# EAGLE design COMP3C (EAGLE 8.4.1)

## Sheet 1 of 3
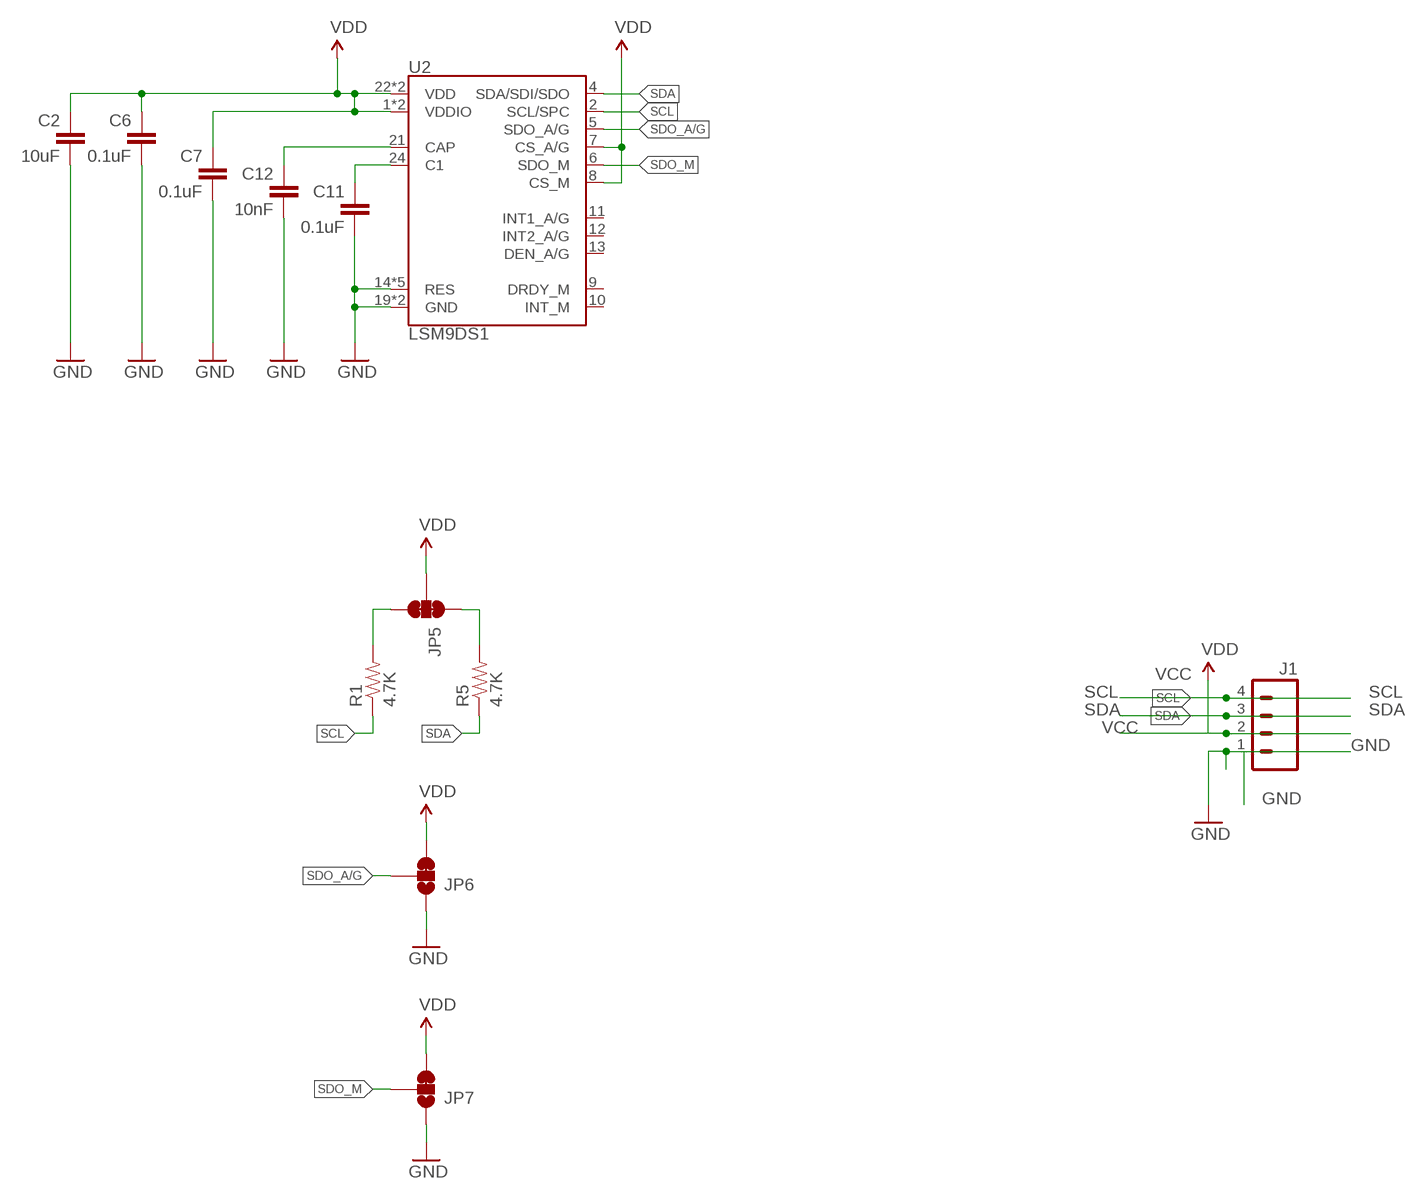
[diagram p0: schematic, sheet 1]

### Parts
C2  10uF  10UF-6.3V-20%(0603)  [0603-CAP]
C6  0.1uF  0.1UF-25V(+80/-20%)(0603)  [0603-CAP]
C7  0.1uF  0.1UF-25V(+80/-20%)(0603)  [0603-CAP]
C11  0.1uF  0.1UF-25V(+80/-20%)(0603)  [0603-CAP]
C12  10nF  10NF/10000PF-50V-10%(0603)  [0603-CAP]
J1  M04NO_SILK_ALL_ROUND  [1X04_NO_SILK_ALL_ROUND]
JP5  JUMPER-PAD-3-NC_BY_TRACE  [PAD-JUMPER-3-3OF3_NC_BY_TRACE_YES_SILK_FULL_BOX]
JP6  JUMPER-PAD-3-2OF3_NC_BY_TRACE_SMALL  [PAD-JUMPER-3-2OF3_NC_BY_TRACE_YES_SILK_FULL_BOX]
JP7  JUMPER-PAD-3-2OF3_NC_BY_TRACE_SMALL  [PAD-JUMPER-3-2OF3_NC_BY_TRACE_YES_SILK_FULL_BOX]
R1  4.7K  4.7KOHM-1/10W-1%(0603)  [0603-RES]
R5  4.7K  4.7KOHM-1/10W-1%(0603)  [0603-RES]
U2  LSM9DS1  [LGA24-8X4]

### Nets
GND: C2.2 C6.2 C7.2 C11.2 C12.2 J1.1 JP6.1 JP7.1 U2.14(RES) U2.15(RES) U2.16(RES) U2.17(RES) U2.18(RES) U2.19(GND) U2.20(GND) ; also sheet 2,3
N$1: JP5.1 R5.2
N$2: JP5.3 R1.2
N$5: C12.1 U2.21(CAP)
N$6: C11.1 U2.24(C1)
SCL: J1.4 R1.1 U2.2(SCL/SPC) ; also sheet 2,3
SDA: J1.3 R5.1 U2.4(SDA/SDI/SDO) ; also sheet 2,3
SDO_A/G: JP6.2 U2.5(SDO_A/G)
SDO_M: JP7.2 U2.6(SDO_M)
VCC: C2.1 C6.1 C7.1 J1.2 JP5.2 JP6.3 JP7.3 U2.1(VDDIO) U2.3(VDDIO) U2.7(CS_A/G) U2.8(CS_M) U2.22(VDD) U2.23(VDD) ; supply symbol labelled VDD ; also sheet 2,3
Unconnected: U2.9(DRDY_M) U2.10(INT_M) U2.11(INT1_A/G) U2.12(INT2_A/G) U2.13(DEN_A/G)

## Sheet 2 of 3
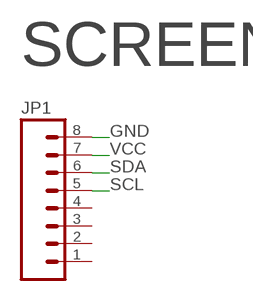
[diagram p1: schematic, sheet 2]

### Parts
JP1  M08LOCK  [1X08_LOCK]

### Nets
GND: JP1.8 ; also sheet 1,3
SCL: JP1.5 ; also sheet 1,3
SDA: JP1.6 ; also sheet 1,3
VCC: JP1.7 ; also sheet 1,3
Unconnected: JP1.1 JP1.2 JP1.3 JP1.4

### Notes on the sheet
- SCREEN

## Sheet 3 of 3
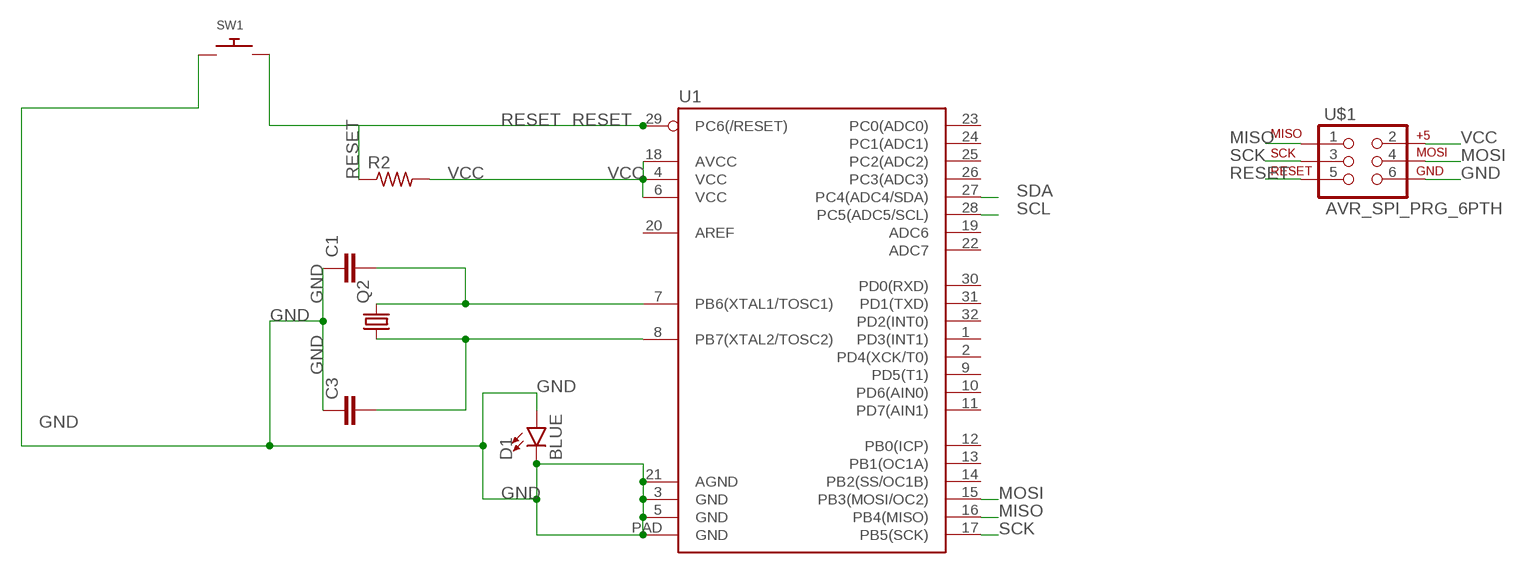
[diagram p2: schematic, sheet 3]

### Parts
C1  C  [C0805]
C3  C  [C0805]
D1  BLUE  LED-BLUE0603  [LED-0603]
Q2  CRYSTALHC49S  [HC49/S]
R2  R-US_R0402  [R0402]
SW1  SWITCH_PUSHBUTTONC&K_KSS  [BTN_CK_KSS]
U1  ATMEGA328P_MLFMLF32  [MLF32-PAD]
U$1  AVR_SPI_PRG_6PTH  [2X3]

### Nets
GND: C1.1 C3.1 D1.A D1.C SW1.P$1 U1.3(GND) U1.5(GND) U1.21(AGND) U1.PAD(GND) U$1.6 ; also sheet 1,2
MISO: U1.16(PB4(MISO)) U$1.1
MOSI: U1.15(PB3(MOSI/OC2)) U$1.4
N$3: C3.2 Q2.1 U1.8(PB7(XTAL2/TOSC2))
N$4: C1.2 Q2.2 U1.7(PB6(XTAL1/TOSC1))
RESET: R2.1 SW1.P$2 U1.29(PC6(/RESET)) U$1.5
SCK: U1.17(PB5(SCK)) U$1.3
SCL: U1.28(PC5(ADC5/SCL)) ; also sheet 1,2
SDA: U1.27(PC4(ADC4/SDA)) ; also sheet 1,2
VCC: R2.2 U1.4(VCC) U1.6(VCC) U1.18(AVCC) U$1.2 ; also sheet 1,2
Unconnected: U1.1(PD3(INT1)) U1.2(PD4(XCK/T0)) U1.9(PD5(T1)) U1.10(PD6(AIN0)) U1.11(PD7(AIN1)) U1.12(PB0(ICP)) U1.13(PB1(OC1A)) U1.14(PB2(SS/OC1B)) U1.19(ADC6) U1.20(AREF) U1.22(ADC7) U1.23(PC0(ADC0)) U1.24(PC1(ADC1)) U1.25(PC2(ADC2)) U1.26(PC3(ADC3)) U1.30(PD0(RXD)) U1.31(PD1(TXD)) U1.32(PD2(INT0))

## Library data of the parts
C1 C3 = eagle-ltspice:C: CAPACITOR, European symbol; MPN: C0805C274K3RACTU; OC_NEWARK: 07X0924; SPICEMODEL: NONE; SPICEPREFIX: C
C2 = SparkFun-Capacitors:10UF-6.3V-20%(0603): CAP-11015; MPN: GRM188C81C106MA73D; OC_NEWARK: 03AC2642; PROD_ID: CAP-11015
C6 C7 C11 = SparkFun-Capacitors:0.1UF-25V(+80/-20%)(0603): CAP-00810 Ceramic Standard decoupling cap; MPN: C0603C104K5RACAUTO; OC_NEWARK: 05AC7990; PROD_ID: CAP-00810
C12 = SparkFun-Capacitors:10NF/10000PF-50V-10%(0603): CAP-00867; MPN: EMK107SD103KA-T; OC_NEWARK: 09J1395; PROD_ID: CAP-00867
D1 = SparkFun-LED:LED-BLUE: Blue SMD LED Used in manufacturing of various products at SparkFun Packages: 0603 - SMD 0603 package [Product Link] <http://www.digikey.com/product-detail/en/SMLE12BC7TT86/511-1589-2-ND/1641808> 1206 - SMD1206 package [Product Link] <http://www.digikey.com/product-detail/en/lite-on-inc/LTST-C150TBKT/160-1643-1-ND/573584> SparkFun Products: ESP8266 Thing-Dev Board <https://www.sparkfun.com/products/13711> RedBoard <https://www.sparkfun.com/products/12757>; MPN: HSMR-C120; OC_NEWARK: 97K1682; PROD_ID: DIO-08575
J1 = SparkFun-Connectors:M04: Header 4 Standard 4-pin 0.1" header. Use with straight break away headers (SKU : PRT-00116), right angle break away headers (PRT-00553), swiss pins (PRT-00743), machine pins (PRT-00117), and female headers (PRT-00115). Molex polarized connector foot print use with SKU : PRT-08231 with associated crimp pins and housings. 1MM SMD Version SKU: PRT-10208; OC_NEWARK: unknown; PROD_ID: CONN-09696
JP1 = SparkFun:M08: Header 8 Standard 8-pin 0.1" header. Use with straight break away headers (SKU : PRT-00116), right angle break away headers (PRT-00553), swiss pins (PRT-00743), machine pins (PRT-00117), and female headers (PRT-00115).; OC_NEWARK: unknown
JP5 = SparkFun-Passives:JUMPER-PAD-3-NC_BY_TRACE; OC_NEWARK: unknown
JP6 JP7 = SparkFun-Passives:JUMPER-PAD-3-2OF3_NC_BY_TRACE; OC_NEWARK: unknown
Q2 = adafruit@1:CRYSTAL: CRYSTAL; MPN: X40M000000L104; OC_FARNELL: 1667008; OC_NEWARK: 59M3626
R1 R5 = SparkFun-Resistors:4.7KOHM-1/10W-1%(0603): RES-07857; MPN: M55342K12B4E70RS3; OC_NEWARK: 17Y8565; PROD_ID: RES-07857
R2 = adafruit:R-US_: RESISTOR, American symbol; MPN: CR0402-FX-1002GLF; OC_NEWARK: 87W5955
SW1 = adafruit:SWITCH_PUSHBUTTON: Buttons SOFTTOUCHSMD_SJ - Soft touch temporary push button (Super Junk Akihabara) Compatible with SKPMANE010 [Mouser: 688-SKPMAN] C&K_KSS = Digikey: KSS221GLFS; MPN: KSS221G LFS; OC_NEWARK: 97K2789
U1 = SparkFun-IC-Microcontroller:ATMEGA328P_MLF: Datasheet SparkFun Products () () 32-Pin Atmega328 part Commonly used on Arduino compatible boards Available in QFP and QFN packages TQFP is IC-09069 QFN is non-stock; MPN: ATMEGA8A-MU; OC_NEWARK: 15AC6102
U2 = SparkFun-Sensors:LSM9DS1: LSM9DS1 3D accelerometer, gyroscope & magnetometer The LSM9DS1 is a system-in-package featuring a 3D digital linear acceleration sensor, a 3D digital angular rate sensor, and a 3D digital magnetic sensor. The LSM9DS1 has a linear acceleration full scale of ±2g/±4g/±8/±16 g, a magnetic field full scale of ±4/±8/±12/±16 gauss and an angular rate of ±245/±500/±2000 dps. The LSM9DS1 includes an I2 C serial bus interface supporting standard and fast mode (100 kHz and 400 kHz) and an SPI serial standard interface. Magnetic, accelerometer and gyroscope sensing can be enabled or set in power-down mode separately for smart power management. The LSM9DS1 is available in a plastic land grid array package (LGA) and it is guaranteed to operate over an extended temperature range from -40 °C to +85 °C.; MPN: LSM9DS1TR; OC_NEWARK: 83Y4306; PROD_ID: IC-12536
U$1 = SparkFun:AVR_SPI_PRG_6: AVR ISP 6 Pin This is the reduced ISP connector for AVR programming. Common on Arduino. This footprint will take up less PCB space and can be used with a 10-pin to 6-pin adapter such as SKU: BOB-08508; MPN: 1023; OC_NEWARK: 31Y5678

## Board
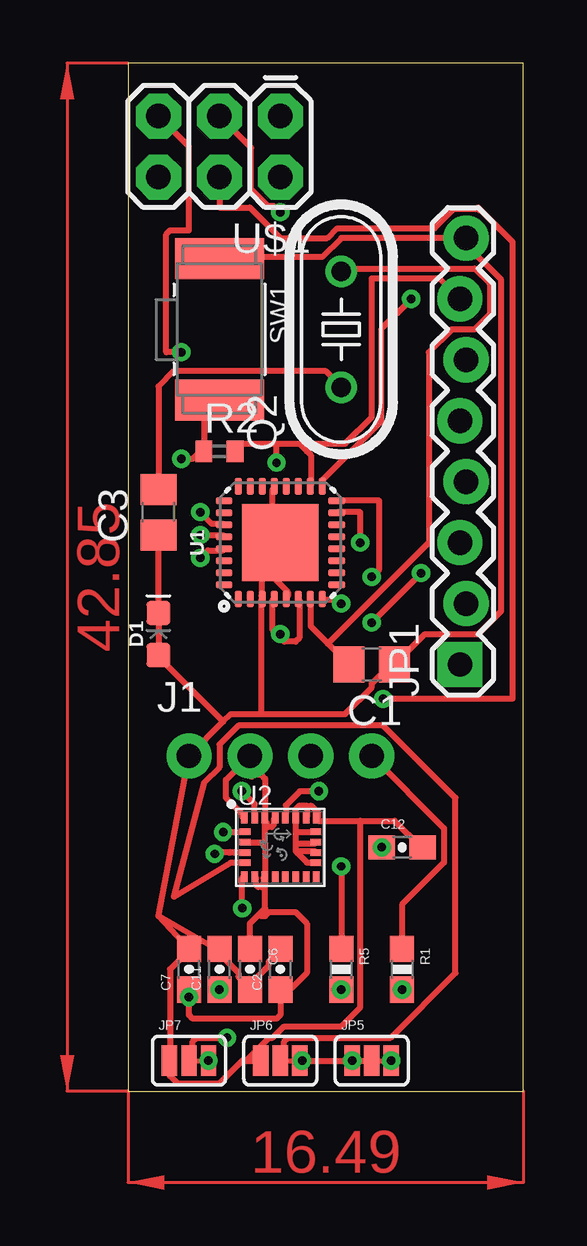
[diagram p3: board, top side]
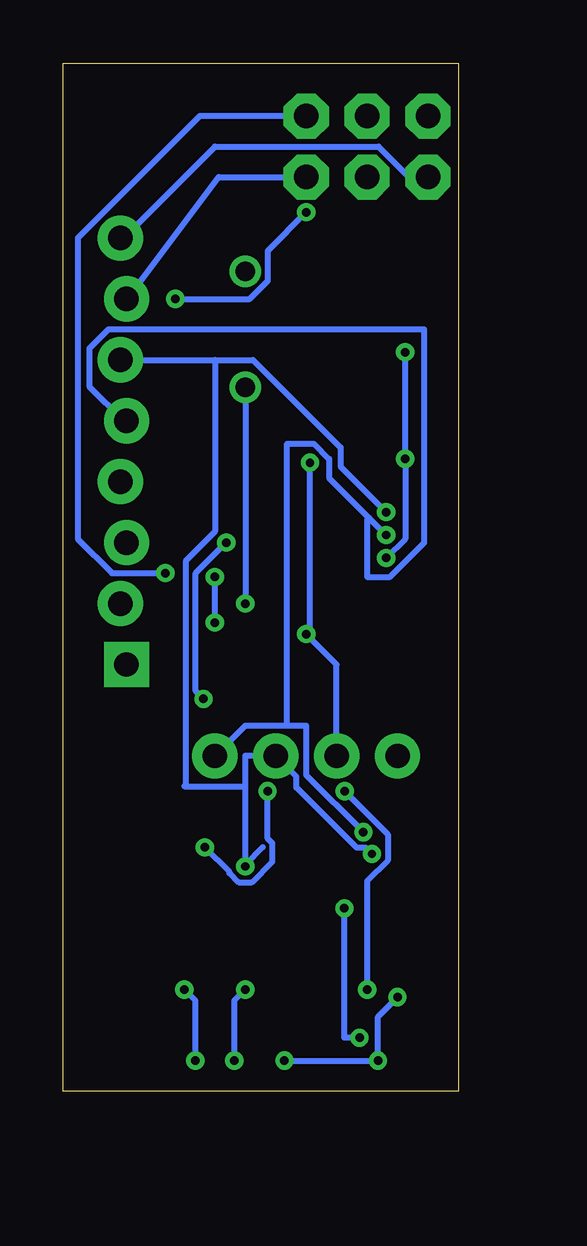
[diagram p4: board, bottom side, seen from below]

Size 16.49 x 42.85 mm. Coordinates in mm from the lower left corner, seen from the top.
Outline: 0,0 16.49,0 16.49,42.85 0,42.85 0,0
Copper layers (1*16): Top 0.035mm / dielectric 1.5mm / Bottom 0.035mm
Design rules "default *": minimum track width 10mil, minimum drill 0.35mm, track to track 6mil, track to pad 6mil, pad to pad 6mil, via to via 6mil, smd to smd 6mil, copper to edge 40mil, drill to drill 6mil, minimum pad ring 10mil, minimum via ring 8mil, stop-mask expansion 4mil, vias tented up to drill 0mil, thermal gap 10mil

### Footprints (pad centres in the part's own frame; a part is rotated, then mirrored left to right if it is on the bottom)
C0805 = smd 1.3 x 1.5: 1 -0.95,0; 2 0.95,0
0603-CAP = smd 1.1 x 1: 1 -0.85,0; 2 0.85,0
LED-0603 = smd 1 x 1: A -0.877,0; C 0.877,0
1X04_NO_SILK_ALL_ROUND = drill 1.016 pad 1.88: 1 0,0; 2 2.54,0; 3 5.08,0; 4 7.62,0
1X08_LOCK = drill 1.016 pad 1.88 square: 1 0,0.127 | drill 1.016 pad 1.88: 2 2.54,-0.127; 3 5.08,0.127; 4 7.62,-0.127; 5 10.16,0.127; 6 12.7,-0.127; 7 15.24,0.127; 8 17.78,-0.127
PAD-JUMPER-3-3OF3_NC_BY_TRACE_YES_SILK_FULL_BOX = smd 0.635 x 1.27: 1 -0.813,0; 2 0,0; 3 0.813,0
PAD-JUMPER-3-2OF3_NC_BY_TRACE_YES_SILK_FULL_BOX = smd 0.635 x 1.27: 1 -0.813,0; 2 0,0; 3 0.813,0
HC49/S = drill 0.813: 1 -2.413,0; 2 2.413,0
0603-RES = smd 1.1 x 1: 1 -0.85,0; 2 0.85,0
R0402 = smd 0.7 x 0.9: 1 -0.65,0; 2 0.65,0
BTN_CK_KSS = smd 1.7 x 3.7: P$1 -2.95,0; P$2 2.95,0
MLF32-PAD = smd 0.7 x 0.3: 1 -2.35,1.75; 2 -2.35,1.25; 3 -2.35,0.75; 4 -2.35,0.25; 5 -2.35,-0.25; 6 -2.35,-0.75; 7 -2.35,-1.25; 8 -2.35,-1.75; 17 2.35,-1.75; 18 2.35,-1.25; 19 2.35,-0.75; 20 2.35,-0.25; 21 2.35,0.25; 22 2.35,0.75; 23 2.35,1.25; 24 2.35,1.75 | smd 0.3 x 0.7: 9 -1.75,-2.35; 10 -1.25,-2.35; 11 -0.75,-2.35; 12 -0.25,-2.35; 13 0.25,-2.35; 14 0.75,-2.35; 15 1.25,-2.35; 16 1.75,-2.35; 25 1.75,2.35; 26 1.25,2.35; 27 0.75,2.35; 28 0.25,2.35; 29 -0.25,2.35; 30 -0.75,2.35; 31 -1.25,2.35; 32 -1.75,2.35 | smd 3.2 x 3.2: PAD 0,0
LGA24-8X4 = smd 0.27 x 0.45: 1 -1.505,1.225; 6 -1.505,-1.225; 7 -1.075,-1.225; 8 -0.645,-1.225; 9 -0.215,-1.225; 10 0.215,-1.225; 11 0.645,-1.225; 12 1.075,-1.225; 13 1.505,-1.225; 18 1.505,1.225; 19 1.075,1.225; 20 0.645,1.225; 21 0.215,1.225; 22 -0.215,1.225; 23 -0.645,1.225; 24 -1.075,1.225 | smd 0.45 x 0.27: 2 -1.475,0.645; 3 -1.475,0.215; 4 -1.475,-0.215; 5 -1.475,-0.645; 14 1.475,-0.645; 15 1.475,-0.215; 16 1.475,0.215; 17 1.475,0.645
2X3 = drill 1.016 pad 1.88 octagon: 1 0,0; 2 0,2.54; 3 2.54,0; 4 2.54,2.54; 5 5.08,0; 6 5.08,2.54

### Placement (x,y rotation side)
C1  10.16,17.78 180 top
C2  6.35,5.08 90 top
C3  1.27,24.13 90 top
C6  5.08,5.08 270 top
C7  2.54,5.08 90 top
C11  3.81,5.08 90 top
C12  11.43,10.16 0 top
D1  1.27,19.05 90 top
J1  2.54,13.97 0 top
JP1  13.97,17.78 90 top
JP5  10.16,1.27 0 top
JP6  6.35,1.27 0 top
JP7  2.54,1.27 0 top
Q2  8.89,31.75 90 top
R1  11.43,5.08 270 top
R2  3.81,26.67 0 top
R5  8.89,5.08 270 top
SW1  3.81,31.75 270 top
U1  6.35,22.86 90 top
U2  6.35,10.16 0 top
U$1  6.35,40.64 180 top

### Tracks (layer width: path | path; a pad name or v marks a point on that pad's centre or on a via)
GND
  Top 0.254: 7.54,11.83 7.62,11.91 7.94,11.59 7.94,11.43 U2.18 7.94,11.27 9.68,11.27 | 7.54,11.83 7.46,11.75 7.46,11.43 U2.19 | 7.06,9.92 6.99,10 6.99,10.32 | 7.06,9.92 7.46,9.53 7.78,9.53 U2.14 | 6.99,10.79 6.99,11.27 U2.20 6.99,11.43 6.99,11.75 7.14,11.91 7.46,11.91 7.54,11.83 | 6.99,10.79 6.99,10.32 | U2.15 7.78,10 7.14,10 7.06,9.92 | 6.99,10.32 7.78,10.32 U2.16 | 6.99,10.79 7.78,10.79 U2.17 | 9.68,11.27 11.11,11.27 12.22,10.16 C12.2 | 3.49,6.03 3.81,6.03 C11.2 3.49,6.03 | 3.49,6.03 1.27,7.3 | 3.49,6.03 4.6,4.92 4.6,4.76 5.08,4.29 C6.2 5.08,4.45 5.87,5.24 5.87,5.4 6.35,5.87 C2.2 | 1.75,1.27 1.75,5.08 2.54,5.87 C7.2 1.27,7.3 | 4.92,1.27 4.76,1.27 3.81,0.32 2.06,0.32 1.75,0.64 1.75,1.27 | 4.92,1.27 JP6.1 | 1.75,1.27 JP7.1 | 9.68,11.27 9.68,3.49 8.89,2.7 6.51,2.7 6.03,2.22 5.87,2.22 4.92,1.27 | 1.27,7.3 J1.1 3.97,15.4 | SW1.P$1 3.81,34.77 8.1,34.77 8.89,35.56 JP1.8 14.13,35.56 14.13,35.24 15.56,33.81 15.56,20 14.61,19.05 12.38,19.05 C1.1 10.95,17.78 10.16,16.99 10.16,16.83 9.05,15.72 5.56,15.72 | 5.56,21.91 5.56,22.07 U1.PAD | 5.56,21.91 5.56,20.64 U1.3 5.56,20.48 5.56,15.72 | U1.21 6.03,25.08 6.03,22.7 U1.PAD | 5.56,21.91 6.67,20.8 6.67,20.64 U1.5 | 5.56,21.91 U1.PAD | C3.1 D1.C D1.A 1.27,18.1 3.97,15.4 | 5.56,15.72 4.29,15.72 3.97,15.4
  Bottom 0.254: U$1.6 2.06,38.1 3.33,39.37 10.16,39.37 13.97,35.56 JP1.8
MISO  (via drill 0.35)
  Top 0.254: v10.16,21.43 10.48,21.75 10.48,24.61 8.73,24.61 U1.16 | v12.22,21.59 v10.16,19.53
  Bottom 0.254: v10.16,19.53 v10.16,21.43 | v12.22,21.59 14.45,21.59 15.88,23.02 15.88,35.56 10.79,40.64 U$1.1
MOSI  (via drill 0.35)
  Top 0.254: v9.68,22.86 9.68,24.13 8.73,24.13 U1.15 | v10.64,16.35 16.03,16.35 16.03,35.4 14.72,36.72 | 14.72,36.72 14.61,36.83 | U$1.4 3.81,36.83 5.08,36.83 6.35,35.56 8.31,35.56 8.72,35.97 12.78,35.97 13.59,36.78 14.6,36.78 14.66,36.72 14.72,36.72
  Bottom 0.254: v9.68,22.86 10.95,21.59 10.95,16.67 v10.64,16.35
N$1  (via drill 0.35)
  Bottom 0.254: JP5.1 9.35,3.77 R5.2
  other vias: 9.35,1.27 8.89,4.23
N$2  (via drill 0.35)
  Bottom 0.254: JP5.3 10.97,3.77 R1.2
  other vias: 10.97,1.27 11.43,4.23
N$3  (via drill 0.35)
  Top 0.254: v8.89,20.32 8.73,20.48 8.1,20.48 U1.8 | C3.2 1.27,29.37 1.91,30 8.26,30 8.89,29.37 Q2.1
  Bottom 0.254: Q2.1 v8.89,20.32
N$4
  Top 0.254: 8.33,18.65 C1.2 | 8.33,18.65 7.62,19.37 7.62,20.48 U1.7 | 8.33,18.65 12.54,22.86 12.54,30.8 13.49,31.75 14.45,31.75 15.08,32.38 15.08,33.65 14.45,34.29 8.89,34.29 Q2.2
N$5  (via drill 0.35)
  Top 0.254: U2.21 6.58,11.4 6.55,11.51 6.58,11.55 6.58,11.92 7.16,12.5 v7.96,12.5
  Bottom 0.254: C12.1 9.55,9.13 9.55,9.09 9.16,8.71 8.62,8.71 7.76,9.57 7.76,10.33 7.96,10.53 v7.96,12.5
  other vias: 10.58,10.16
N$6  (via drill 0.35)
  Top 0.254: U2.24 5.28,11.97 v4.74,12.5
  Bottom 0.254: v4.74,12.5 2.95,10.71 2.95,9.61 3.81,8.76 C11.1
  other vias: 3.81,4.23
RESET  (via drill 0.35)
  Top 0.254: v3.02,22.23 3.33,22.54 3.97,22.54 U1.29 | v2.22,26.35 2.7,26.35 3.02,26.67 R2.1 3.17,26.67 3.17,28.1 3.81,28.73 SW1.P$2 | U$1.5 2.54,39.37 2.54,35.88 1.75,35.88 1.59,35.72 1.59,30.8 v2.22,30.8
  Bottom 0.254: v3.02,22.23 2.22,23.02 v2.22,26.35 v2.22,30.8
SCK  (via drill 0.35)
  Top 0.254: v11.81,33.02 10.57,31.78 10.57,27.93 8.1,25.46 U1.17 | v6.35,36.63 6.1,36.88 5.84,36.88 5.13,37.59 5.13,39.32 U$1.3
  Bottom 0.254: v6.35,36.63 7.95,35.03 7.95,33.77 8.7,33.02 v11.81,33.02
SCL  (via drill 0.35)
  Top 0.254: v3.97,10.79 4.76,10.79 U2.2 | R1.1 11.43,7.78 13.18,9.53 13.18,10.95 J1.4 | v3.02,23.18 3.97,23.18 U1.28
  Bottom 0.254: v3.97,10.79 6.35,13.18 6.35,15.24 7.14,15.24 | 7.14,15.24 8.89,15.24 J1.4 | 3.73,23.89 5.4,25.56 5.4,26.35 6.03,26.99 7.14,26.99 7.14,15.24 | 3.73,23.89 v3.02,23.18 | JP1.5 13.97,27.94 15.4,29.37 15.4,30.96 14.61,31.75 1.43,31.75 1.43,22.86 2.86,21.43 3.81,21.43 3.81,23.81 3.73,23.89
SDA  (via drill 0.35)
  Top 0.254: v8.89,9.37 R5.1 | U2.4 4.4,9.95 | 4.4,9.95 4.39,9.95 | 4.4,9.95 4.28,9.95 4.22,9.96 4.2,9.95 3.67,9.95 v3.61,9.89 | v3.02,24.13 3.49,23.65 3.97,23.65 U1.27
  Bottom 0.254: 8.89,9.43 8.89,12.7 | 8.89,12.7 8.89,13.97 J1.3 6.76,13.11 6.76,12.65 4.24,10.14 3.86,10.14 v3.61,9.89 | 8.89,9.43 v8.89,9.37 | 8.16,10.16 8.89,9.43 | v3.02,24.13 4.92,26.04 4.92,26.83 8.57,30.48 10.16,30.48 | JP1.6 10.16,30.48 | 8.89,12.7 11.43,12.7 11.38,12.75 11.38,22.09 10.16,23.31 10.16,30.48
SDO_A/G
  Top 0.254: U2.5 4.76,9.53 4.29,9.53 1.91,8.1 3.17,12.86 3.81,13.49 3.81,14.45 4.6,15.24 10.64,15.24 13.65,12.22 13.65,4.92 10.95,2.22 6.67,2.22 6.51,2.06 6.51,1.27 JP6.2
SDO_M  (via drill 0.35)
  Top 0.254: v4.76,7.62 4.76,8.89 U2.6 | v4.13,2.22 2.86,2.22 2.7,2.06 2.7,1.27 JP7.2
  Bottom 0.254: v4.76,7.62 4.76,2.22 v4.13,2.22
VCC  (via drill 0.35)
  Top 0.254: C7.1 v2.54,3.92 2.54,3.18 2.7,3.02 6.19,3.02 6.35,3.18 C2.1 6.35,4.29 6.83,4.29 7.46,4.92 7.46,6.99 6.99,7.46 5.87,7.46 5.71,7.3 5.56,7.3 5.48,7.38 | 5.48,7.38 5.08,6.99 C6.1 | 5.48,7.38 5.71,7.62 5.71,8.89 U2.8 | 4.76,11.43 U2.1 4.84,11.47 4.09,12.23 4.09,12.98 J1.2 5.08,13.18 5.16,13.1 5.24,13.18 5.56,13.18 5.71,13.02 5.71,11.43 U2.23 5.71,11.27 | 5.71,10.32 5.71,9.05 U2.8 | 5.71,10.32 5.71,11.27 | JP5.2 v7.26,1.27 JP6.3 | U2.8 5.64,8.87 5.64,8.6 5.55,8.51 5.43,8.51 5.34,8.6 5.34,8.87 U2.7 | U2.22 6.07,11.32 6.07,11.1 5.98,11.01 5.86,11.01 5.77,11.1 5.77,11.22 5.71,11.27 | U2.3 5.66,10.38 5.71,10.32 | 7.46,26.67 7.14,26.99 6.19,26.99 | 7.46,26.67 7.62,26.51 7.62,25.24 U1.18 | 6.19,26.99 4.45,26.99 4.45,26.67 R2.2 | 6.27,18.97 6.51,18.73 6.99,18.73 7.14,18.89 7.14,20.48 U1.6 | 6.27,18.97 6.03,19.21 6.03,20.48 U1.4 | v6.35,19.05 6.27,18.97 | v6.19,26.19 6.19,26.99 | 7.46,26.67 7.78,26.99 9.05,26.99 10.16,28.1 10.16,33.88 12.98,33.88 JP1.7 13.81,33.02
  Bottom 0.254: v2.54,3.92 3.35,3.1 JP7.3 v7.26,1.27 | J1.2 5.08,17.78 v6.35,19.05 6.19,19.05 v6.19,26.19 | U$1.2 10,38.1 13.81,33.02 JP1.7
  other vias: 3.35,1.27
(copper drawn outside any net)
  shapes: Top area x2